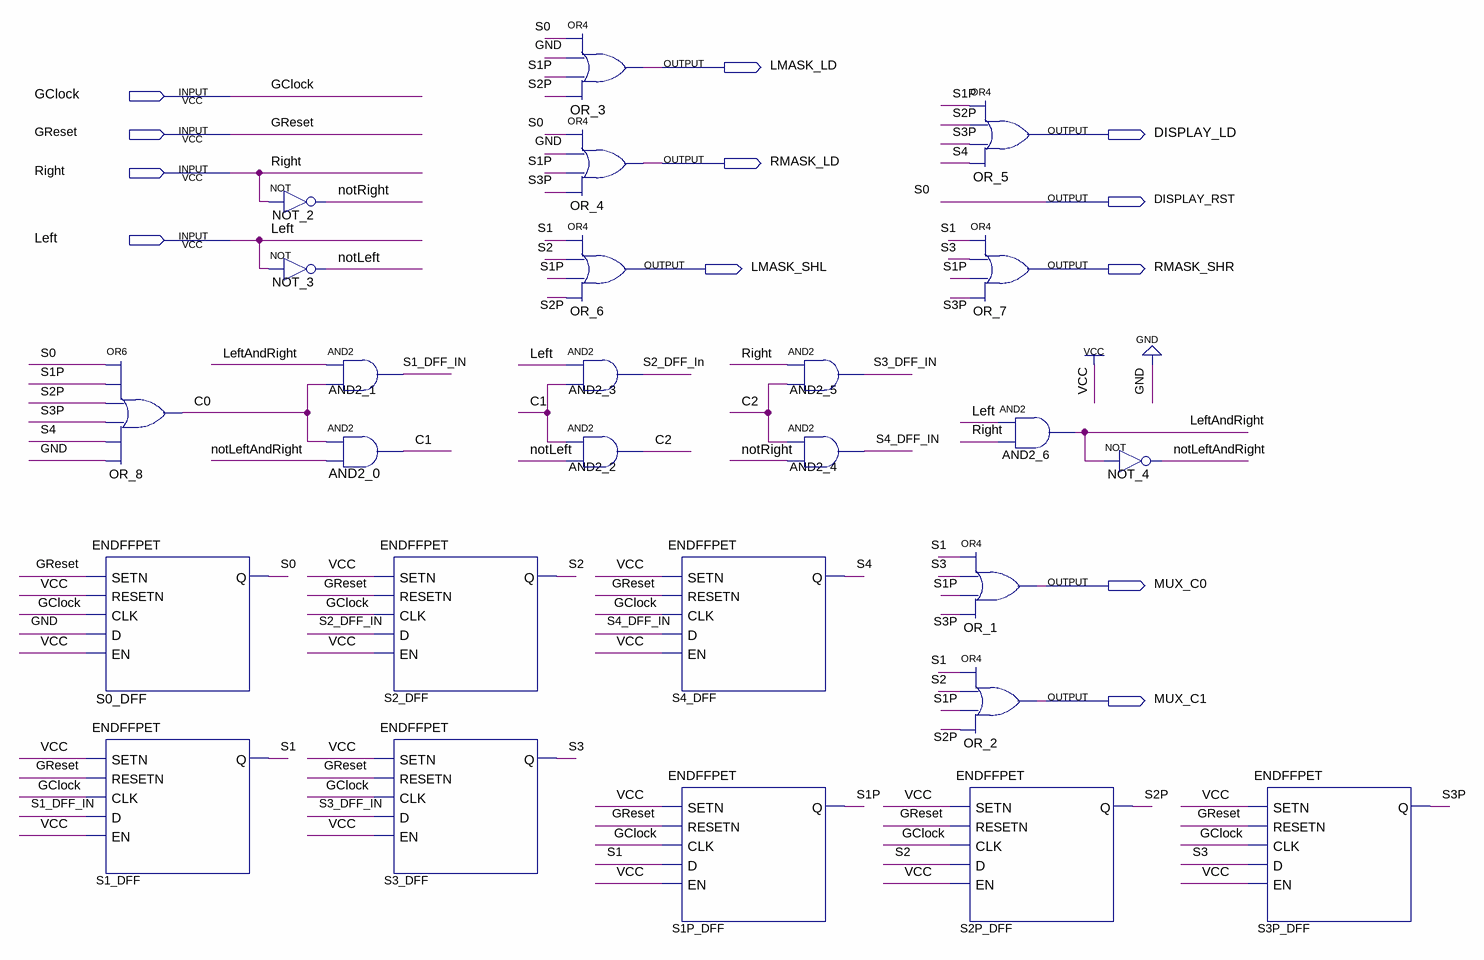
[diagram p0: schematic sheet]
// Quartus schematic ControlPath.bdf as structural Verilog: 26 symbols, 12 pins
module ControlPath (
  input  GClock,
  input  GReset,
  input  Right,
  input  Left,
  output LMASK_LD,
  output DISPLAY_LD,
  output RMASK_LD,
  output DISPLAY_RST,
  output LMASK_SHL,
  output RMASK_SHR,
  output MUX_C0,
  output MUX_C1
);

  wire C0, C1, C2, LeftAndRight, notLeft, notLeftAndRight, notRight, S1, S1_DFF_IN, S1P, S2, S2_DFF_In, S2P,
       S3, S3_DFF_IN, S3P, S4, S4_DFF_IN;

  or OR_8 (C0, DISPLAY_RST, S1P, S2P, S3P, S4, 1'b0);
  ENDFFPET S0_DFF (.SETN(GReset), .RESETN(1'b1), .CLK(GClock), .D(1'b0), .EN(1'b1), .Q(DISPLAY_RST));
  ENDFFPET S1_DFF (.SETN(1'b1), .RESETN(GReset), .CLK(GClock), .D(S1_DFF_IN), .EN(1'b1), .Q(S1));
  not NOT_2 (notRight, Right);
  not NOT_3 (notLeft, Left);
  and AND2_1 (S1_DFF_IN, LeftAndRight, C0);
  and AND2_0 (C1, C0, notLeftAndRight);
  ENDFFPET S2_DFF (.SETN(1'b1), .RESETN(GReset), .CLK(GClock), .D(S2_DFF_In), .EN(1'b1), .Q(S2));
  ENDFFPET S3_DFF (.SETN(1'b1), .RESETN(GReset), .CLK(GClock), .D(S3_DFF_IN), .EN(1'b1), .Q(S3));
  or OR_3 (LMASK_LD, DISPLAY_RST, 1'b0, S1P, S2P);
  or OR_4 (RMASK_LD, DISPLAY_RST, 1'b0, S1P, S3P);
  or OR_6 (LMASK_SHL, S1, S2, S1P, S2P);
  and AND2_3 (S2_DFF_In, Left, C1);
  and AND2_2 (C2, C1, notLeft);
  ENDFFPET S4_DFF (.SETN(1'b1), .RESETN(GReset), .CLK(GClock), .D(S4_DFF_IN), .EN(1'b1), .Q(S4));
  ENDFFPET S1P_DFF (.SETN(1'b1), .RESETN(GReset), .CLK(GClock), .D(S1), .EN(1'b1), .Q(S1P));
  and AND2_5 (S3_DFF_IN, Right, C2);
  and AND2_4 (S4_DFF_IN, C2, notRight);
  or OR_5 (DISPLAY_LD, S1P, S2P, S3P, S4);
  or OR_7 (RMASK_SHR, S1, S3, S1P, S3P);
  or OR_1 (MUX_C0, S1, S3, S1P, S3P);
  or OR_2 (MUX_C1, S1, S2, S1P, S2P);
  ENDFFPET S2P_DFF (.SETN(1'b1), .RESETN(GReset), .CLK(GClock), .D(S2), .EN(1'b1), .Q(S2P));
  and AND2_6 (LeftAndRight, Left, Right);
  not NOT_4 (notLeftAndRight, LeftAndRight);
  ENDFFPET S3P_DFF (.SETN(1'b1), .RESETN(GReset), .CLK(GClock), .D(S3), .EN(1'b1), .Q(S3P));

  // Other names for the same wires on the sheet: S0 = DISPLAY_RST
endmodule
